# Altium schematic sheet LMR14050_mod.SchDoc
size B
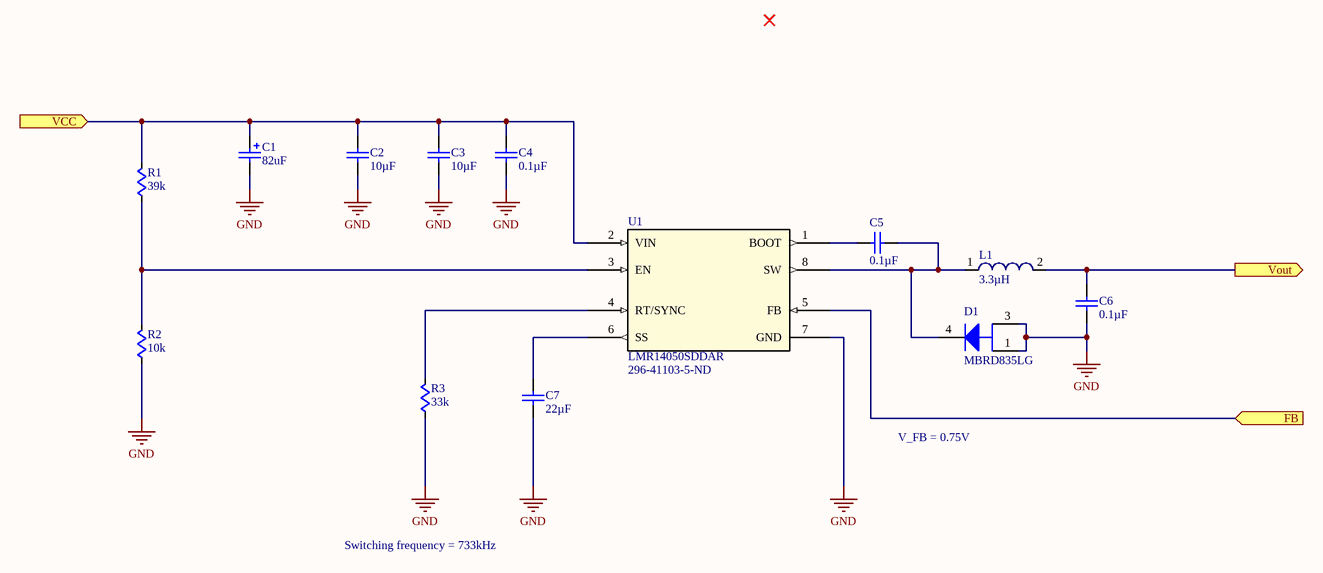
[diagram p0: LMR14050_mod.SchDoc]

## Parts
C1  value 82uF  [CAP_EEFK_D8]  (hidden comment: EEEFK1V680XP)
C2  value 10µF  [C0805]  (hidden comment: Cap)
C3  value 10µF  [C0805]  (hidden comment: Cap)
C4  value 0.1µF  [C0805]  (hidden comment: Cap)
C5  value 0.1µF  [C0805]  (hidden comment: Cap)
C6  value 0.1µF  [C0805]  (hidden comment: Cap)
C7  value 22µF  [C0805]  (hidden comment: Cap)
D1  MBRD835LG  [ONSC-DPAK-3-369C-01_V]
L1  value 3.3µH  [IHLP-2525C7]  (hidden comment: Ind)
R1  value 39k  [R0805]  (hidden comment: Res)
R2  value 10k  [R0805]  (hidden comment: Res)
R3  value 33k  [R0805]  (hidden comment: Res)
U1  LMR14050SDDAR  Supplier Part Number 1: 296-41103-5-ND  [DDA8]

## Ports
FB (in), VCC (in), Vout (out)

## Nets
GND: C1.2 C2.1 C3.1 C4.1 C6.1 C7.1 D1.1(A) D1.3(A) R2.1 R3.1 U1.7(GND)
FB: U1.5(FB) ; port FB
VCC: C1.1 C2.2 C3.2 C4.2 R1.2 U1.2(VIN) ; port VCC
Vout: C6.2 L1.2 ; port Vout
NetC5_1: C5.1 D1.4(K) L1.1 U1.8(SW)
NetC5_2: C5.2 U1.1(BOOT)
NetC7_2: C7.2 U1.6(SS)
NetR1_1: R1.1 R2.2 U1.3(EN)
NetR3_2: R3.2 U1.4(RT/SYNC)

## Notes on the sheet
- V_FB = 0.75V
- Switching frequency = 733kHz

## Library data of the parts
C1 = EEEFK1V680XP: Polarized Capacitor (Surface Mount); Vendor: Panasonic; Built_By: EMA_UL_Team; C: Copyright (C) 2015 Accelerated Designs. All rights reserved; Manufacturer_Part_Number: EEEFK1V680XP; Supplier 1: Digi-Key; Supplier Part Number 1: P18960DKR-ND
C2-C7 = Cap: capacitor
D1 = CMP-1055-00169-1: SWITCHMODE(TM) Power Rectifier, 3-Pin DPAK, Pb-Free, Tube; Manufacturer: On Semiconductor; IFSM Max (A): 75; Configuration: Single; RoHS: TRUE; ComponentLink1Description: Manufacturer URL; PackageDescription: 3-Pin Flange Mount, Body 6.54 x 6.095 mm, Pitch 2.29 mm; Packing: Tube; ComponentLink2URL: http://www.onsemi.cn/pub_link/Collateral/MBRD835L-D.PDF; DatasheetVersion: Rev. 11; PackageVersion: Rev. E, 02/2014; ComponentLink3URL: http://www.onsemi.cn/pub_link/Collateral/369C.PDF; ComponentLink1URL: http://www.onsemi.com/; PackageReference: DPAK-3-369C-01; ComponentLink2Description: Datasheet; Mounting Technology: Surface Mount; ComponentLink3Description: Package Specification; PartNumber: MBRD835LG
L1 = Ind: Inductor; Supplier 1: Digi-Key; Supplier Part Number 1: 541-2580-1-ND
R1-R3 = Res: resistor
U1 = LMR14050SDDAR: dc-dc converter; Vendor: Texas Instruments; Built_By: EMA_UL_Team; C: Copyright (C) 2016 Accelerated Designs. All rights reserved; Manufacturer_Part_Number: LMR14050SDDAR; Value: Value; Type: Type; RefDes: RefDes; Supplier 1: Digi-Key